# Altium schematic sheet BatteryCharger.SchDoc
size B
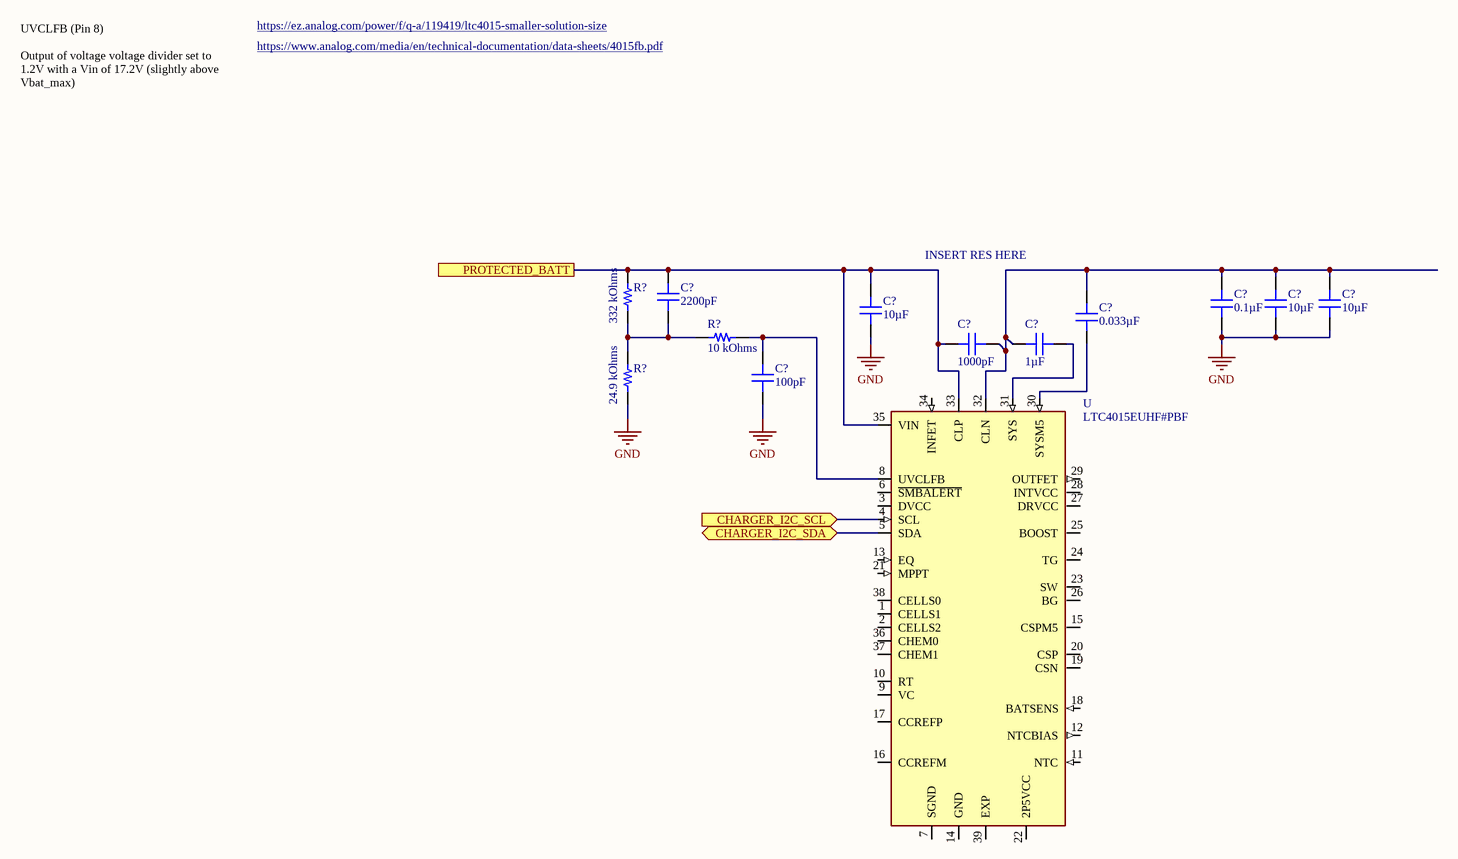
[diagram p0: BatteryCharger.SchDoc]

## Parts
(Parts that share a designator on the sheet are numbered #1, #2 ... from top to bottom, then left to right.)
C?#1  2200pF  [CAP 0603_1608]
C?#2  0.1µF  [CAP 0603_1608]
C?#3  10µF  [CAP 0805_2012]
C?#4  10µF  [CAP 0805_2012]
C?#5  10µF  [CAP 0805_2012]
C?#6  0.033µF  [CAP 0603_1608]
C?#7  1000pF  [CAP 0603_1608]
C?#8  1µF  [CAP 0603_1608]
C?#9  100pF  [CAP 0603_1608]
R?#1  332 kOhms  [RES 0603_1608]
R?#2  10 kOhms  [RES 0603_1608]
R?#3  24.9 kOhms  [RES 0603_1608]
U  LTC4015EUHF#PBF  [QFN50P700X500X80-39N]

## Ports
CHARGER_I2C_SCL (in), CHARGER_I2C_SDA (bidir), PROTECTED_BATT

## Nets
GND: C?#2.1 C?#3.1 C?#4.1 C?#5.1 C?#9.1 R?#3.1
CHARGER_I2C_SCL: U.4(SCL) ; port CHARGER_I2C_SCL
CHARGER_I2C_SDA: U.5(SDA) ; port CHARGER_I2C_SDA
PROTECTED_BATT: C?#1.2 C?#5.2 C?#7.1 R?#1.2 U.33(CLP) U.35(VIN) ; port PROTECTED_BATT
NetC?#1_1: C?#1.1 R?#1.1 R?#2.1 R?#3.2
NetC?#2_2: C?#2.2 C?#3.2 C?#4.2 C?#6.2 C?#7.2 C?#8.1 U.32(CLN)
NetC?#6_1: C?#6.1 U.30(SYSM5)
NetC?#8_2: C?#8.2 U.31(SYS)
NetC?#9_2: C?#9.2 R?#2.2 U.8(UVCLFB)

Not connected (* = marked no-connect by the designer): U 1(CELLS1) 2(CELLS2) 3(DVCC) 6(~{SMBALERT}) 7(SGND) 9(VC) 10(RT) 11(NTC) 12(NTCBIAS) 13(EQ) 14(GND) 15(CSPM5) 16(CCREFM) 17(CCREFP) 18(BATSENS) 19(CSN) 20(CSP) 21(MPPT) 22(2P5VCC) 23(SW) 24(TG) 25(BOOST) 26(BG) 27(DRVCC) 28(INTVCC) 29(OUTFET) 34(INFET) 36(CHEM0) 37(CHEM1) 38(CELLS0) 39(EXP)

## Notes on the sheet
- https://ez.analog.com/power/f/q-a/119419/ltc4015-smaller-solution-size
- https://www.analog.com/media/en/technical-documentation/data-sheets/4015fb.pdf
- UVCLFB (Pin 8)
  Output of voltage voltage divider set to 1.2V with a Vin of 17.2V (slightly above Vbat_max)
- INSERT RES HERE

## Library data of the parts
C?#1 = VJ0603Y222KXACW1BC: CAP CER 2200PF 50V X7R 0603; Manufacturer: Vishay Vitramon; Tolerance: ±10%; Part Number: VJ0603Y222KXACW1BC; Value: 2200pF; Applications: General Purpose; Capacitance: 2200pF; ComponentLink1Description: Datasheet; ComponentLink1URL: https://www.vishay.com/docs/28548/vjw1bcbascomseries.pdf; ComponentLink2Description: DigiKey Link; ComponentLink2URL: http://digikey.com/product-detail/en/vishay-vitramon/VJ0603Y222KXACW1BC/720-1600-1-ND/421005; Device Package: 0603 (1608 Metric); LastUpdated: 1/21/2020 12:01:49 AM; Lifecycle Status: Active; Minimum Order: 1; Mounting Type: Surface Mount, MLCC; Operating Temperature: -55°C ~ 125°C; Package / Case: 0603 (1608 Metric); Packaging: TapeAndReel; PartId: 14237; Part Status: Active; Price: 0.01; Series: VJ; Size / Dimension: 0.063" L x 0.031" W (1.60mm x 0.80mm); Supplier 1: DigiKey; Supplier Part Number 1: 720-1600-1-ND; Temperature Coefficient: X7R; Thickness (Max): 0.035" (0.90mm); Voltage - Rated: 50V
C?#2 = UMK107BJ104KAHT: CAP CER 0.1UF 50V X5R 0603; Manufacturer: Taiyo Yuden; Tolerance: ±10%; Part Number: UMK107BJ104KAHT; Value: 0.1µF; Applications: Automotive; Capacitance: 0.1µF; ComponentLink1Description: Datasheet; ComponentLink1URL: https://www.yuden.co.jp/productdata/catalog/mlcc06_hq_e.pdf; ComponentLink2Description: DigiKey Link; ComponentLink2URL: http://digikey.com/product-detail/en/taiyo-yuden/UMK107BJ104KAHT/587-3504-1-ND/4157267; Device Package: 0603 (1608 Metric); LastUpdated: 1/21/2020 12:02:06 AM; Lifecycle Status: Active; Minimum Order: 1; Mounting Type: Surface Mount, MLCC; Operating Temperature: -55°C ~ 85°C; Package / Case: 0603 (1608 Metric); Packaging: TapeAndReel; PartId: 4294; Part Status: Active; Price: 0.02; Ratings: AEC-Q200; Series: M; Size / Dimension: 0.063" L x 0.031" W (1.60mm x 0.80mm); Supplier 1: DigiKey; Supplier Part Number 1: 587-3504-1-ND; Temperature Coefficient: X5R; Thickness (Max): 0.035" (0.90mm); Voltage - Rated: 50V
C?#3-C?#5 = GRM21BC8YA106KE11L: CAP CER 10UF 35V X6S 0805; Manufacturer: Murata Electronics; Tolerance: ±10%; Part Number: GRM21BC8YA106KE11L; Value: 10µF; Applications: General Purpose; Capacitance: 10µF; ComponentLink1Description: Datasheet; ComponentLink1URL: https://search.murata.co.jp/Ceramy/image/img/A01X/G101/ENG/GRM21BC8YA106KE11-01.pdf; ComponentLink2Description: DigiKey Link; ComponentLink2URL: http://digikey.com/product-detail/en/murata-electronics/GRM21BC8YA106KE11L/490-10504-1-ND/5026432; Device Package: 0805 (2012 Metric); LastUpdated: 1/21/2020 12:02:43 AM; Lifecycle Status: Active; Minimum Order: 1; Mounting Type: Surface Mount, MLCC; Operating Temperature: -55°C ~ 105°C; Package / Case: 0805 (2012 Metric); Packaging: TapeAndReel; PartId: 16091; Part Status: Active; Price: 0.12; Series: GRM; Size / Dimension: 0.079" L x 0.049" W (2.00mm x 1.25mm); Supplier 1: DigiKey; Supplier Part Number 1: 490-10504-1-ND; Temperature Coefficient: X6S; Thickness (Max): 0.057" (1.45mm); Voltage - Rated: 35V
C?#6 = VJ0603Y333KXACW1BC: CAP CER 0.033UF 50V X7R 0603; Manufacturer: Vishay Vitramon; Tolerance: ±10%; Part Number: VJ0603Y333KXACW1BC; Value: 0.033µF; Applications: General Purpose; Capacitance: 0.033µF; ComponentLink1Description: Datasheet; ComponentLink1URL: https://www.vishay.com/docs/28548/vjw1bcbascomseries.pdf; ComponentLink2Description: DigiKey Link; ComponentLink2URL: http://digikey.com/product-detail/en/vishay-vitramon/VJ0603Y333KXACW1BC/720-1694-1-ND/8324114; Device Package: 0603 (1608 Metric); LastUpdated: 1/21/2020 12:02:00 AM; Lifecycle Status: Active; Minimum Order: 1; Mounting Type: Surface Mount, MLCC; Operating Temperature: -55°C ~ 125°C; Package / Case: 0603 (1608 Metric); Packaging: TapeAndReel; PartId: 8069; Part Status: Active; Price: 0.02; Series: VJ; Size / Dimension: 0.063" L x 0.031" W (1.60mm x 0.80mm); Supplier 1: DigiKey; Supplier Part Number 1: 720-1694-1-ND; Temperature Coefficient: X7R; Thickness (Max): 0.037" (0.95mm); Voltage - Rated: 50V
C?#7 = VJ0603Y102KXAPW1BC: CAP CER 1000PF 50V X7R 0603; Manufacturer: Vishay Vitramon; Tolerance: ±10%; Part Number: VJ0603Y102KXAPW1BC; Value: 1000pF; Applications: General Purpose; Capacitance: 1000pF; ComponentLink1Description: Datasheet; ComponentLink1URL: https://www.vishay.com/docs/28548/vjw1bcbascomseries.pdf; ComponentLink2Description: DigiKey Link; ComponentLink2URL: http://digikey.com/product-detail/en/vishay-vitramon/VJ0603Y102KXAPW1BC/720-VJ0603Y102KXAPW1BCCT-ND/11198400; Device Package: 0603 (1608 Metric); LastUpdated: 1/21/2020 12:01:34 AM; Lifecycle Status: Active; Minimum Order: 1; Mounting Type: Surface Mount, MLCC; Operating Temperature: -55°C ~ 125°C; Package / Case: 0603 (1608 Metric); Packaging: TapeAndReel; PartId: 26262; Part Status: Active; Price: 0.01; Series: VJ; Size / Dimension: 0.063" L x 0.031" W (1.60mm x 0.80mm); Supplier 1: DigiKey; Supplier Part Number 1: 720-VJ0603Y102KXAPW1BCCT-ND; Temperature Coefficient: X7R; Thickness (Max): 0.034" (0.87mm); Voltage - Rated: 50V
C?#8 = UMK107BJ105MA-T: CAP CER 1UF 50V X5R 0603; Manufacturer: Taiyo Yuden; Tolerance: ±20%; Part Number: UMK107BJ105MA-T; Value: 1µF; Applications: General Purpose; Capacitance: 1µF; ComponentLink1Description: Datasheet; ComponentLink1URL: https://www.yuden.co.jp/productdata/catalog/mlcc01_e.pdf; ComponentLink2Description: DigiKey Link; ComponentLink2URL: http://digikey.com/product-detail/en/taiyo-yuden/UMK107BJ105MA-T/587-5959-1-ND/7675079; Device Package: 0603 (1608 Metric); LastUpdated: 1/21/2020 12:01:54 AM; Lifecycle Status: Active; Minimum Order: 1; Mounting Type: Surface Mount, MLCC; Operating Temperature: -55°C ~ 85°C; Package / Case: 0603 (1608 Metric); Packaging: TapeAndReel; PartId: 11682; Part Status: Active; Price: 0.03; Series: M; Size / Dimension: 0.063" L x 0.031" W (1.60mm x 0.80mm); Supplier 1: DigiKey; Supplier Part Number 1: 587-5959-1-ND; Temperature Coefficient: X5R; Thickness (Max): 0.035" (0.90mm); Voltage - Rated: 50V
C?#9 = VJ0603Y101KXACW1BC: CAP CER 100PF 50V X7R 0603; Manufacturer: Vishay Vitramon; Tolerance: ±10%; Part Number: VJ0603Y101KXACW1BC; Value: 100pF; Applications: General Purpose; Capacitance: 100pF; ComponentLink1Description: Datasheet; ComponentLink1URL: https://www.vishay.com/docs/28548/vjw1bcbascomseries.pdf; ComponentLink2Description: DigiKey Link; ComponentLink2URL: http://digikey.com/product-detail/en/vishay-vitramon/VJ0603Y101KXACW1BC/720-1373-1-ND/3986127; Device Package: 0603 (1608 Metric); LastUpdated: 1/21/2020 12:01:52 AM; Lifecycle Status: Active; Minimum Order: 1; Mounting Type: Surface Mount, MLCC; Operating Temperature: -55°C ~ 125°C; Package / Case: 0603 (1608 Metric); Packaging: TapeAndReel; PartId: 13001; Part Status: Active; Price: 0.01; Series: VJ; Size / Dimension: 0.063" L x 0.031" W (1.60mm x 0.80mm); Supplier 1: DigiKey; Supplier Part Number 1: 720-1373-1-ND; Temperature Coefficient: X7R; Thickness (Max): 0.037" (0.95mm); Voltage - Rated: 50V
R?#1 = RMCF0603FT332K: RES 332K OHM 1% 1/10W 0603; Manufacturer: Stackpole Electronics Inc; Power (Watts): 0.1W, 1/10W; Temperature Coefficient: ±100ppm/°C; Part Number: RMCF0603FT332K; Value: 332 kOhms; ComponentLink1Description: Datasheet; ComponentLink1URL: https://www.seielect.com/catalog/sei-rmcf_rmcp.pdf; ComponentLink2Description: DigiKey Link; ComponentLink2URL: http://digikey.com/product-detail/en/stackpole-electronics-inc/RMCF0603FT332K/RMCF0603FT332KCT-ND/1943133; Composition: Thick Film; Device Package: 0603 (1608 Metric); Features: Automotive AEC-Q200; Height - Seated (Max): 0.022" (0.55mm); LastUpdated: 1/21/2020 12:22:37 AM; Lifecycle Status: Active; Minimum Order: 1; Number of Terminations: 2; Operating Temperature: -55°C ~ 155°C; Package / Case: 0603 (1608 Metric); Packaging: CutTape; PartId: 10657; Part Status: Active; Price: 0.10; Ratings: AEC-Q200; Resistance: 332 kOhms; Series: RMCF; Size / Dimension: 0.061" L x 0.031" W (1.55mm x 0.80mm); Supplier 1: DigiKey; Supplier Part Number 1: RMCF0603FT332KCT-ND; Supplier Device Package: 0603; Tolerance: ±1%
R?#2 = RNCP0603FTD10K0: RES 10K OHM 1% 1/8W 0603; Manufacturer: Stackpole Electronics Inc; Power (Watts): 0.125W, 1/8W; Temperature Coefficient: ±100ppm/°C; Part Number: RNCP0603FTD10K0; Value: 10 kOhms; ComponentLink1Description: Datasheet; ComponentLink1URL: https://www.seielect.com/catalog/sei-rncp.pdf; ComponentLink2Description: DigiKey Link; ComponentLink2URL: http://digikey.com/product-detail/en/stackpole-electronics-inc/RNCP0603FTD10K0/RNCP0603FTD10K0CT-ND/2240478; Composition: Thin Film; Device Package: 0603 (1608 Metric); Features: Anti-Sulfur, Moisture Resistant; Height - Seated (Max): 0.020" (0.50mm); LastUpdated: 1/21/2020 12:17:35 AM; Lifecycle Status: Active; Minimum Order: 1; Number of Terminations: 2; Operating Temperature: -55°C ~ 155°C; Package / Case: 0603 (1608 Metric); Packaging: TapeAndReel; PartId: 22616; Part Status: Active; Price: 0.01; Resistance: 10 kOhms; Series: RNCP; Size / Dimension: 0.059" L x 0.031" W (1.50mm x 0.80mm); Supplier 1: DigiKey; Supplier Part Number 1: RNCP0603FTD10K0CT-ND; Supplier Device Package: 0603; Tolerance: ±1%
R?#3 = RNCP0603FTD24K9: RES 24.9K OHM 1% 1/8W 0603; Manufacturer: Stackpole Electronics Inc; Power (Watts): 0.125W, 1/8W; Temperature Coefficient: ±100ppm/°C; Part Number: RNCP0603FTD24K9; Value: 24.9 kOhms; ComponentLink1Description: Datasheet; ComponentLink1URL: https://www.seielect.com/catalog/sei-rncp.pdf; ComponentLink2Description: DigiKey Link; ComponentLink2URL: http://digikey.com/product-detail/en/stackpole-electronics-inc/RNCP0603FTD24K9/RNCP0603FTD24K9CT-ND/2240491; Composition: Thin Film; Device Package: 0603 (1608 Metric); Features: Anti-Sulfur, Moisture Resistant; Height - Seated (Max): 0.020" (0.50mm); LastUpdated: 1/21/2020 12:24:38 AM; Lifecycle Status: Active; Minimum Order: 1; Number of Terminations: 2; Operating Temperature: -55°C ~ 155°C; Package / Case: 0603 (1608 Metric); Packaging: TapeAndReel; PartId: 5725; Part Status: Active; Price: 0.01; Resistance: 24.9 kOhms; Series: RNCP; Size / Dimension: 0.059" L x 0.031" W (1.50mm x 0.80mm); Supplier 1: DigiKey; Supplier Part Number 1: RNCP0603FTD24K9CT-ND; Supplier Device Package: 0603; Tolerance: ±1%
U = LTC4015EUHF#PBF: Charger IC Multi-Chemistry 38-QFN _5x7_; MF: Analog Devices; Price: None; SnapEDA_Link: https://www.snapeda.com/parts/LTC4015EUHF%23PBF/Analog%20Devices/view-part/2603016/?ref=snap; MP: LTC4015EUHF#PBF; Availability: Unavailable; Value: *; Package: QFN -38 Analog Devices